# Altium project ET4207_DEBUG.PrjPcb
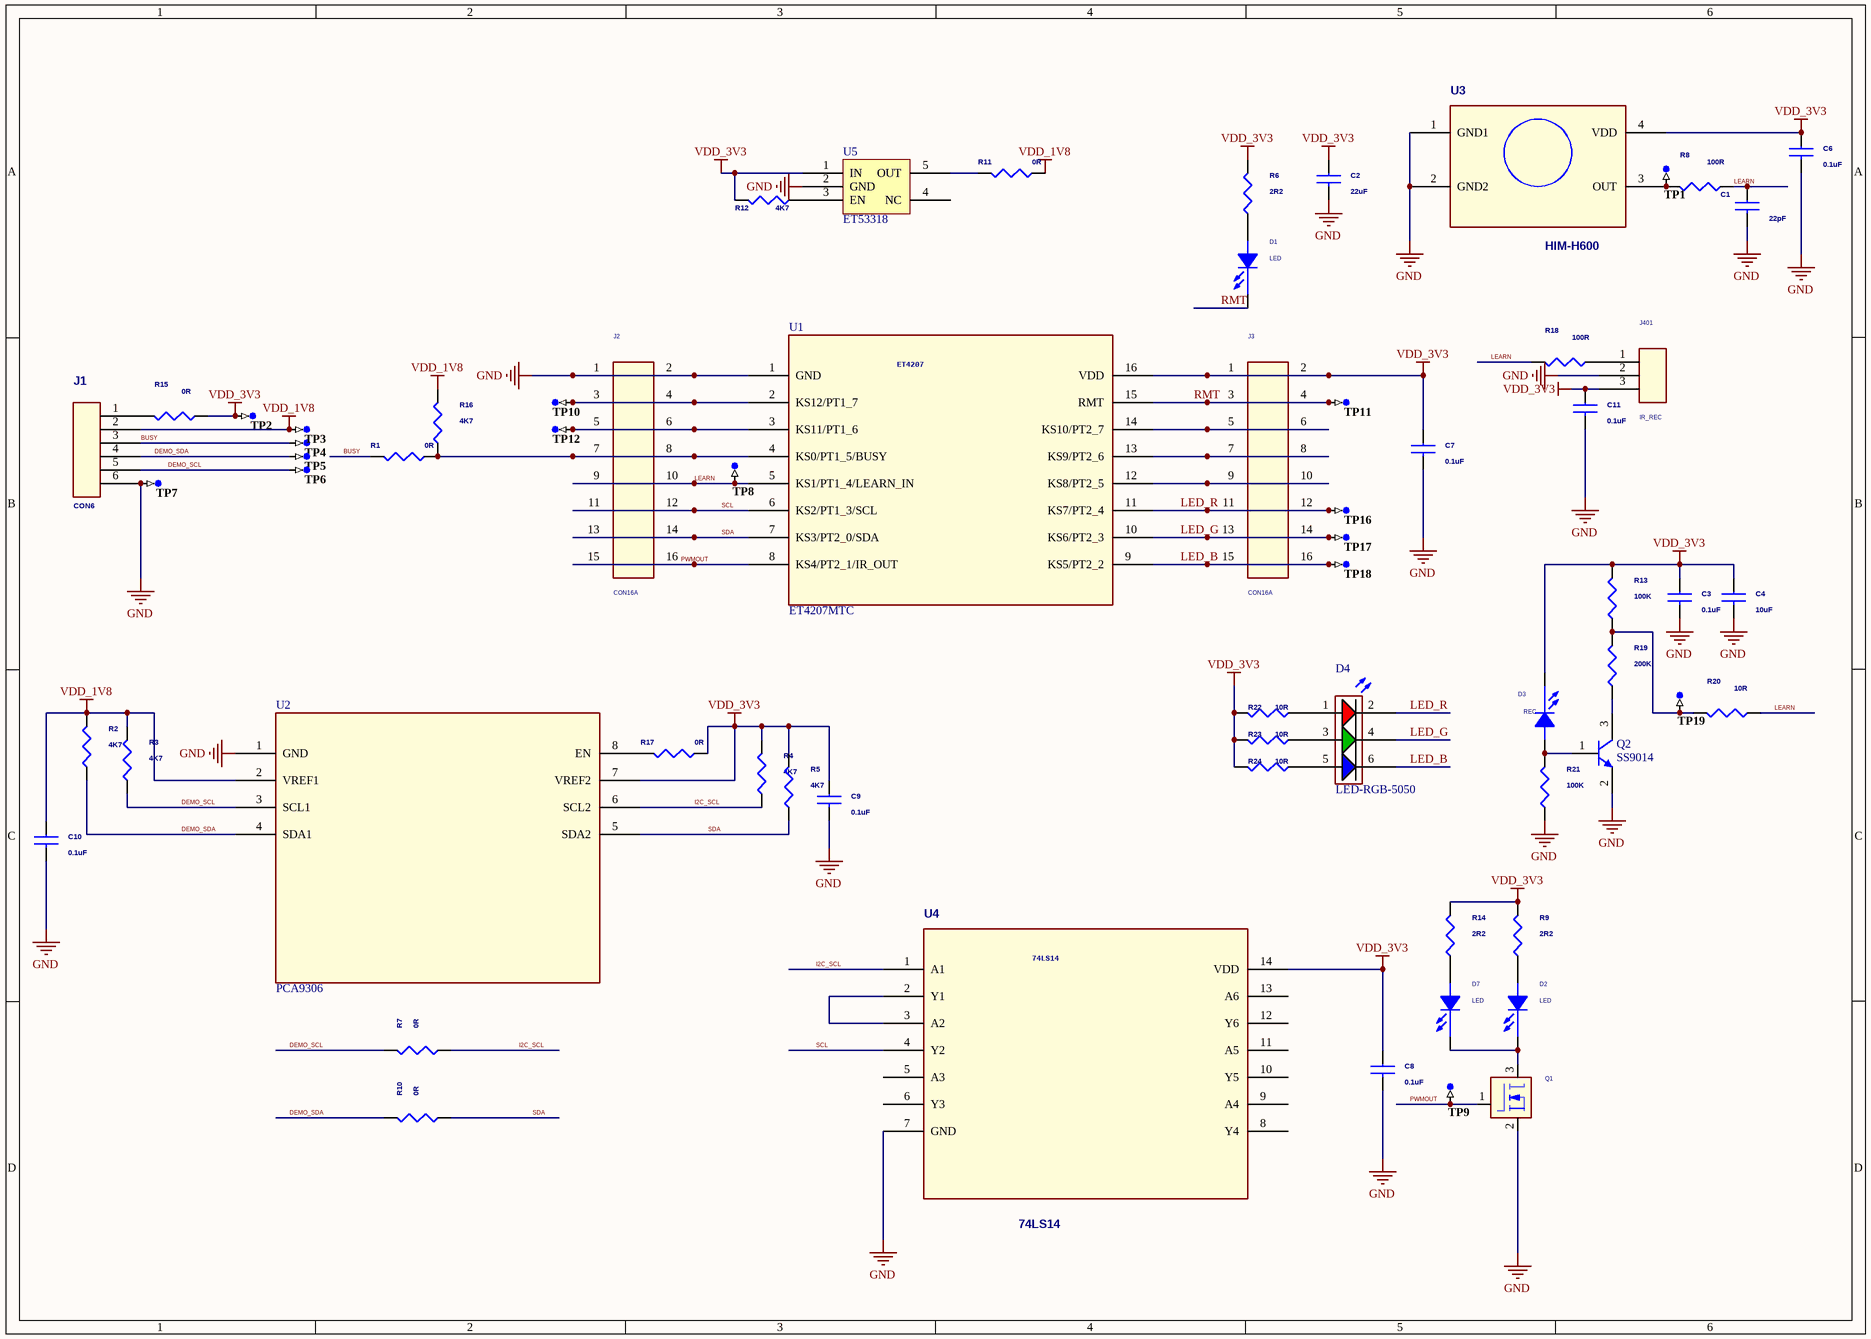
[diagram p0: ET4207_DEBUG.SchDoc]
1 sheet, 66 parts. Net scope: global (net labels, ports and power ports of the same name join across sheets).
Board file: ET4207_DEBUG.PcbDoc

## Sheet ET4207_DEBUG.SchDoc
size 350 x 250 mm

### Parts
C1  22pF  [0805C]
C2  22uF  [0805C]
C3  0.1uF  [0805C]
C4  10uF  [0805C]
C6  0.1uF  [0805C]
C7  0.1uF  [0805C]
C8  0.1uF  [0805C]
C9  0.1uF  [0805C]
C10  0.1uF  [0805C]
C11  0.1uF  [0805C]
D1  LED  [LED_A2]
D2  LED  [LED-0805]
D3  REC  [LED_A2]
D4  LED-RGB-5050  [LED-5050]
D7  LED  [LED_A2]
J1  CON6  [HDR1X6]
J2  CON16A  [DIP16-2.54]
J3  CON16A  [DIP16-2.54]
J401  IR_REC  [IR]
Q1  AO3400  [SOT-23]  (value not drawn)
Q2  SS9014  [SOT23-3]
R1  0R  [0805R]
R2  4K7  [0805R]
R3  4K7  [0805R]
R4  4K7  [0805R]
R5  4K7  [0805R]
R6  2R2  [0805R]
R7  0R  [0805R]
R8  100R  [0805R]
R9  2R2  [0805R]
R10  0R  [0805R]
R11  0R  [0805R]
R12  4K7  [0805R]
R13  100K  [0805R]
R14  2R2  [0805R]
R15  0R  [0805R]
R16  4K7  [0805R]
R17  0R  [0805R]
R18  100R  [0805R]
R19  200K  [0805R]
R20  10R  [0805R]
R21  100K  [0805R]
R22  10R  [0805R]
R23  10R  [0805R]
R24  10R  [0805R]
TP1  PULSE  [TP-SM-C-100]  (value not drawn)  (no BOM)
TP2  3V3  [TP-SM-C-100]  (value not drawn)  (no BOM)
TP3  1V8  [TP-SM-C-100]  (value not drawn)  (no BOM)
TP4  BUSY  [TP-SM-C-100]  (value not drawn)  (no BOM)
TP5  SDA  [TP-SM-C-100]  (value not drawn)  (no BOM)
TP6  SCL  [TP-SM-C-100]  (value not drawn)  (no BOM)
TP7  GND  [TP-SM-C-100]  (value not drawn)  (no BOM)
TP8  LEARN  [TP-SM-C-100]  (value not drawn)  (no BOM)
TP9  IROUT  [TP-SM-C-100]  (value not drawn)  (no BOM)
TP10  PT17  [TP-SM-C-100]  (value not drawn)  (no BOM)
TP11  SCL  [TP-SM-C-100]  (value not drawn)  (no BOM)
TP12  PT16  [TP-SM-C-100]  (value not drawn)  (no BOM)
TP16  PT24  [TP-SM-C-100]  (value not drawn)  (no BOM)
TP17  PT23  [TP-SM-C-100]  (value not drawn)  (no BOM)
TP18  PT22  [TP-SM-C-100]  (value not drawn)  (no BOM)
TP19  DIODE_V  [TP-SM-C-100]  (value not drawn)  (no BOM)
U1  ET4207MTC  [soic-16]
U2  PCA9306  [DCT-G8]
U3  HIM-H600  [HIM-H600]
U4  74LS14  [SOIC-14]
U5  ET53318  [SOT23-5]

### Nets
GND: C1.2 C2.2 C3.2 C4.2 C6.2 C7.2 C8.2 C9.2 C10.2 C11.2 J1.6 J2.1 J2.2 J401.2(GND) Q1.2(S) Q2.2(E) R21.1 TP7.1 U1.1(GND) U2.1(GND) U3.1(GND1) U3.2(GND2) U4.7(GND) U5.2(GND)
VDD_1V8: C10.1 J1.2 R2.2 R3.2 R11.1 R16.2 TP3.1 U2.2(VREF1)
VDD_3V3: C2.1 C3.1 C4.1 C6.1 C7.1 C8.1 C9.1 C11.1 D3.2(CATHODE) J3.1 J3.2 J401.3(VCC) R4.2 R5.2 R6.2 R9.2 R12.2 R13.2 R14.2 R15.1 R17.1 R22.2 R23.2 R24.2 TP2.1 U1.16(VDD) U2.7(VREF2) U3.4(VDD) U4.14(VDD) U5.1(IN)
BUSY: J1.3 R1.2 TP4.1
DEMO_SCL: J1.5 R3.1 R7.2 TP6.1 U2.3(SCL1)
DEMO_SDA: J1.4 R2.1 R10.2 TP5.1 U2.4(SDA1)
I2C_SCL: R4.1 R7.1 U2.6(SCL2) U4.1(A1)
LEARN: C1.1 J2.9 J2.10 R8.1 R18.2 R20.1 TP8.1 U1.5(KS1/PT1_4/LEARN_IN)
LED_B: D4.6(B) J3.15 J3.16 TP18.1 U1.9(KS5/PT2_2)
LED_G: D4.4(G) J3.13 J3.14 TP17.1 U1.10(KS6/PT2_3)
LED_R: D4.2(R) J3.11 J3.12 TP16.1 U1.11(KS7/PT2_4)
PWMOUT: J2.15 J2.16 Q1.1(G) TP9.1 U1.8(KS4/PT2_1/IR_OUT)
RMT: D1.2(CATHODE) J3.3 J3.4 TP11.1 U1.15(RMT)
SCL: J2.11 J2.12 U1.6(KS2/PT1_3/SCL) U4.4(Y2)
SDA: J2.13 J2.14 R5.1 R10.1 U1.7(KS3/PT2_0/SDA) U2.5(SDA2)
NetD1_1: D1.1(ANODE) R6.1
NetD2_1: D2.1(ANODE) R9.1
NetD2_2: D2.2(CATHODE) D7.2(CATHODE) Q1.3(D)
NetD3_1: D3.1(ANODE) Q2.1(B) R21.2
NetD4_1: D4.1(R) R22.1
NetD4_3: D4.3(A) R23.1
NetD4_5: D4.5(R) R24.1
NetD7_1: D7.1(ANODE) R14.1
NetJ1_1: J1.1 R15.2
NetJ2_3: J2.3 J2.4 TP10.1 U1.2(KS12/PT1_7)
NetJ2_5: J2.5 J2.6 TP12.1 U1.3(KS11/PT1_6)
NetJ2_7: J2.7 J2.8 R1.1 R16.1 U1.4(KS0/PT1_5/BUSY)
NetJ3_5: J3.5 J3.6 U1.14(KS10/PT2_7)
NetJ3_7: J3.7 J3.8 U1.13(KS9/PT2_6)
NetJ3_9: J3.9 J3.10 U1.12(KS8/PT2_5)
NetJ401_1: J401.1(IROUT) R18.1
NetQ2_3: Q2.3(C) R19.1
NetR8_2: R8.2 TP1.1 U3.3(OUT)
NetR11_2: R11.2 U5.5(OUT)
NetR12_1: R12.1 U5.3(EN)
NetR13_1: R13.1 R19.2 R20.2 TP19.1
NetR17_2: R17.2 U2.8(EN)
NetU4_2: U4.2(Y1) U4.3(A2)

Not connected (* = marked no-connect by the designer): U4 5(A3) 6(Y3) 8(Y4) 9(A4) 10(Y5) 11(A5) 12(Y6) 13(A6); U5 4(NC)

### Notes on the sheet
- (in symbol ET4207MTC) ET4207

### Library data of the parts
C1-C4 C6-C11 = CAPACITOR NON-POL
D1-D3 D7 = LED_3
D4 = LED-RGB-5050: 三基色LED; Published: 8-Jun-2000; LatestRevisionDate: 08-Jul-2005; LatestRevisionNote: Mech Layer 1 removed.; PackageReference: LED-0; Publisher: Altium Limited
J2 J3 = CON16A_0
J401 = CON3_0
Q1 = MOSFET_I_EN_GSD: MOSFET N-CH 50V 200MA SOT-23; TI_Part_No: TI-MOS-BSS138LT3G; Mfr_Part_Number: BSS138LT3G; Mfr_Name: On Semi; Distributor_Part_Number: BSS138LT3GOSCT-ND; Datasheet: http://www.onsemi.com/pub_link/Collateral/BSS138LT1-D.PDF
Q2 = SS9014: NPN贴片三极管; Published: 8-Jun-2000; LatestRevisionDate: 15-Jan-2003; LatestRevisionNote: PCB Footprint 'BCY-W3/D4.7' replaced; DatasheetDocument: 1997; PackageDocument: Sep-1998; PackageReference: TO-92A; Publisher: Altium Limited; Code_JEDEC: TO-92A; ComponentLink1Description: Manufacturer Link; ComponentLink1URL: http://www.fairchildsemi.com/; ComponentLink2Description: Datasheet; ComponentLink2URL: http://www.fairchildsemi.com/ds/2N%2F2N3904.pdf
R1-R24 = RESISTOR: MODULE: CPU
TP1-TP12 TP16-TP19 = TP-SM: Test Point, Surface Mount, Circular, Pad Diameter 1 mm
U3 = LPC111x_7: DEVICE: ET4003YD; MODULE: CPU
U4 = STM32F103C8_1
U5 = ET53333